# Altium schematic sheet Sheet3.SchDoc
size A4; SheetNumber: 1; SheetTotal: 1
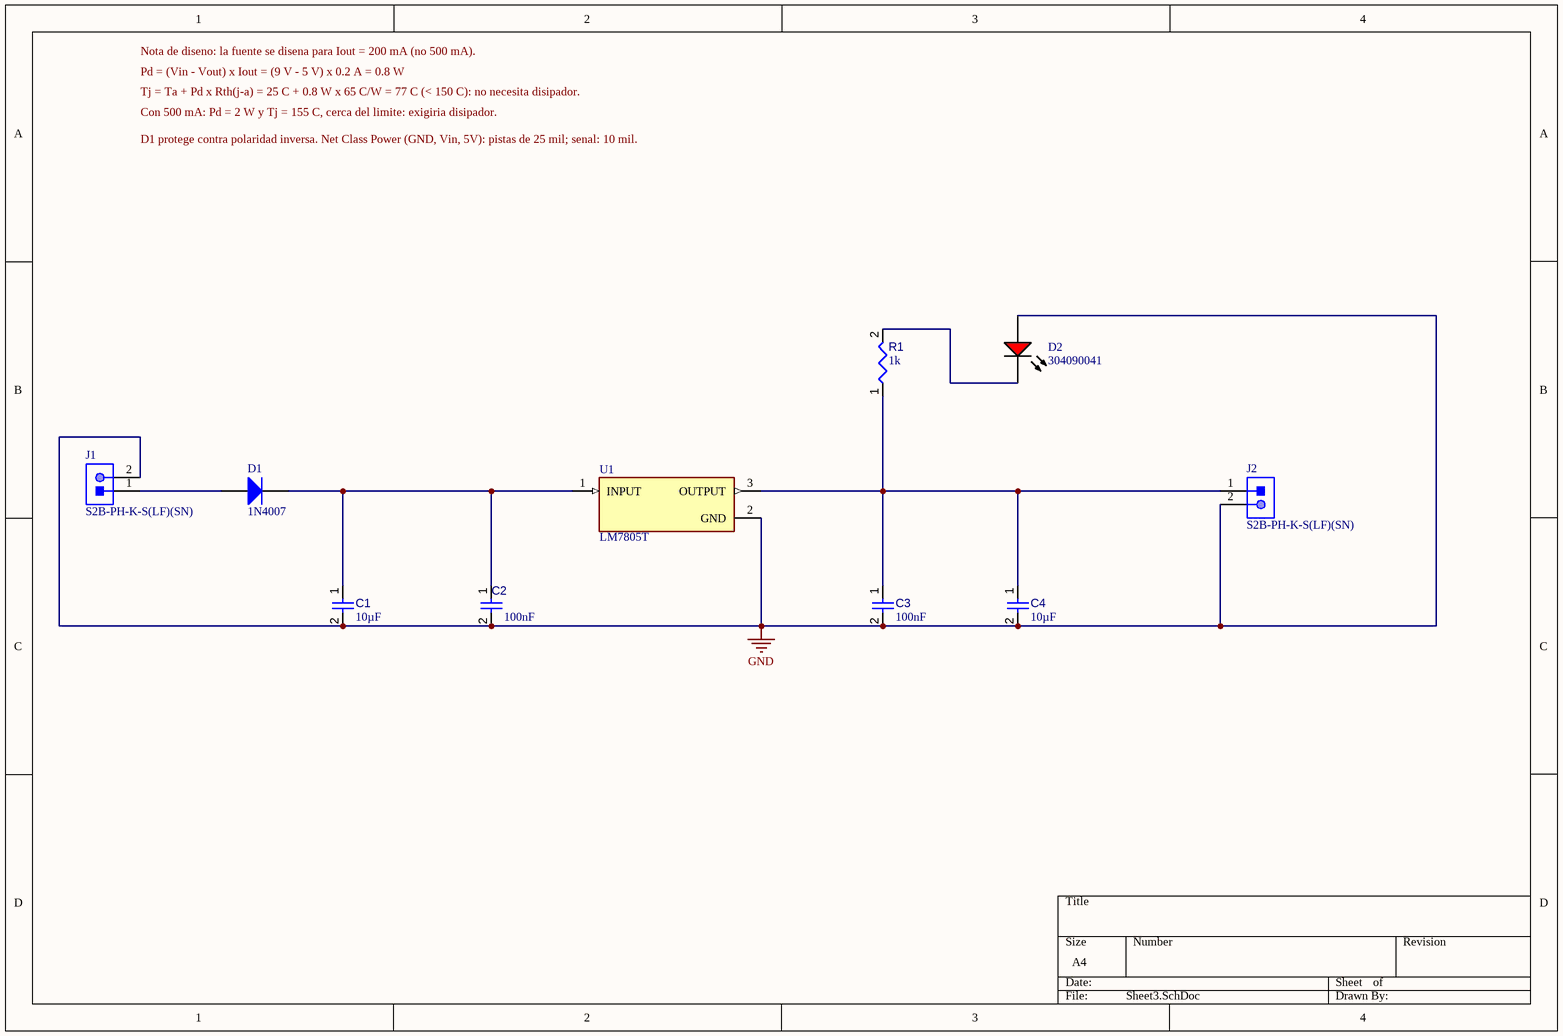
[diagram p0: Sheet3.SchDoc]

## Parts
C1  value 10µF  [CAPC0805(2012)145_L]  (hidden comment: Capacitor 10µF +/-20% 25V 0805)
C2  value 100nF  [CAPC0402(1005)60_L]  (hidden comment: Capacitor 100nF +/-20% 25V 0402)
C3  value 100nF  [CAPC0402(1005)60_L]  (hidden comment: Capacitor 100nF +/-20% 25V 0402)
C4  value 10µF  [CAPC0805(2012)145_L]  (hidden comment: Capacitor 10µF +/-20% 25V 0805)
D1  1N4007  [FAIR-DO-41-2]
D2  304090041  [LED-2P-2.28-3MM_A]
J1  S2B-PH-K-S(LF)(SN)  [JST-S2B-PH-K-S_V]
J2  S2B-PH-K-S(LF)(SN)  [JST-S2B-PH-K-S_V]
R1  value 1k  [RESC0402(1005)_L]  (hidden comment: 1KR2J)
U1  LM7805T  [TO254P1011X457X1950-3]

## Nets
GND: C1.2 C2.2 C3.2 C4.2 D2.1(A) J1.2 J2.2 U1.2(GND)
NetC1_1: C1.1 C2.1 D1.1(K) U1.1(INPUT)
NetC3_1: C3.1 C4.1 J2.1 R1.1 U1.3(OUTPUT)
NetD1_2: D1.2(A) J1.1
NetD2_2: D2.2(K) R1.2

## Notes on the sheet
- Nota de diseno: la fuente se disena para Iout = 200 mA (no 500 mA).
- Pd = (Vin - Vout) x Iout = (9 V - 5 V) x 0.2 A = 0.8 W
- Tj = Ta + Pd x Rth(j-a) = 25 C + 0.8 W x 65 C/W = 77 C (< 150 C): no necesita disipador.
- Con 500 mA: Pd = 2 W y Tj = 155 C, cerca del limite: exigiria disipador.
- D1 protege contra polaridad inversa. Net Class Power (GND, Vin, 5V): pistas de 25 mil; senal: 10 mil.

## Library data of the parts
C1 C4 = CMP-001-00079-4: Chip Capacitor, 10µF +/-20%, 25V, 0805, Thickness 1.45 mm; Tolerance: 10%; Max Operating Temperature: 85°C; Case/Package: 0805; Voltage Rating: 25V; Min Operating Temperature: -55°C; Mounting Technology: SMT; Pins: 2
C2 C3 = CMP-001-00065-4: Chip Capacitor, 100nF +/-20%, 25V, 0402, Thickness 0.6 mm; Tolerance: 10%; Max Operating Temperature: 85°C; Min Operating Temperature: -55°C; Pins: 2; Voltage Rating: 25V; Mounting Technology: SMT; Case/Package: 0402
D1 = CMP-004-00007-2: General Purpose Rectifier, 1.1 V, 1.0 A, -55 to 175 degC, 2-Pin DO-41, RoHS, Tape and Reel; Manufacturer: Fairchild; Peak Reverse Current: 5uA; Max Surge Current: 30A; Elements: 1; Forward Voltage: 1.1V; Package Version: Rev. 2, 09/2008; Forward Current: 1A; Package Quantity: 5000; Packaging: TapeandReel; Package URL: http://www.fairchildsemi.com/dwg/DO/DO41A.pdf; Manufacturer URL: https://www.fairchildsemi.com/; Package Reference: DO-41-2; Pins: 2; Min Operating Temperature: -55°C; Datasheet Version: Rev. 1.1.0, 11/2014; Max Operating Temperature: 175°C; RoHS Compliant: True; Case/Package: DO-41-2; Mounting Technology: TH; Package Description: 2-Pin Axial Lead, Dia 2.375 mm, Body Length 4.63 mm; Datasheet URL: https://www.fairchildsemi.com/datasheets/1N/1N4007.pdf
D2 = CMP-007-00007-2: Red LED, 80 mW, 30 mA, -25 to 85 degC, 2-Pin THD; Manufacturer: Shenzhen CGX; Package Description: 2-Pin Through Hole Device, Dia 3 mm, Pitch 2.28 mm; Datasheet URL: http://datasheet.octopart.com/304090041-Chengguangxing-datasheet-62330656.pdf; Mounting Technology: TH; Manufacturer URL: http://szcgx.com/; RoHS Compliant: Unknown; Datasheet Version: Sep-14; Case/Package: 304090041; Package Reference: 304090041
J1 J2 = CMP-002-00030-2: Male Header, Pitch 2 mm, 1 x 2 Position, Height 4.8 mm, Tail Length 3.4 mm, -25 to 85 degC, RoHS, Bulk; Manufacturer: Japan Solderless Terminals; Package Reference: S2B-PH-K-S; Case/Package: S2B-PH-K-S; Datasheet URL: http://www.jst-mfg.com/product/pdf/eng/ePH.pdf; RoHS Compliant: Unknown; Datasheet Version: Dec-12; Gender: Male; Min Operating Temperature: -25°C; Max Operating Temperature: 85°C; Package Description: Male Header, Pitch 2 mm, 1 x 2 Position, Height 4.8 mm, Tail Length 3.4 mm; Connector Type: Header; Mounting Technology: SM
R1 = CMP-009-00075-2: 1K 0.063W 5% 0402 (1005 Metric)  SMD; Power: 63mW; Pins: 2; Mounting Technology: SMT; Case/Package: 0402; Tolerance: 5%
U1 = LM7805T: 3-Terminal 1.5A Positive Fixed Voltage Regulator; MF: TAEJIN; SnapEDA_Link: https://www.snapeda.com/parts/LM7805T/TAEJIN/view-part/?ref=snap; Package: TO-220-3 TAEJIN; Value: *; MP: LM7805T; Check_prices: https://www.snapeda.com/parts/LM7805T/TAEJIN/view-part/?ref=eda